# EAGLE design basic-schematic (EAGLE 7.3.0)
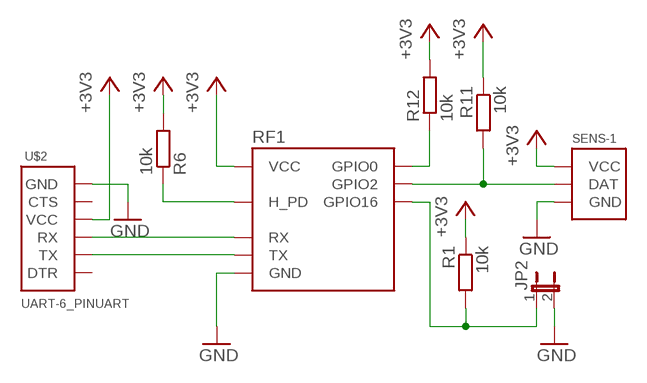
[diagram p0: schematic, sheet 1]

## Parts
JP2  JP1E  [JP1]
R1  10k  R-EU_0207/7  [0207/7]
R6  10k  R-EU_0207/7  [0207/7]
R11  10k  R-EU_0207/7  [0207/7]
R12  10k  R-EU_0207/7  [0207/7]
RF1  ESP2866-ESP-01THT  [ESP8266-ESP-01]
SENS-1  DHT11DHT11  [SENSOR-DHT11]
U$2  UART-6_PINUART  [ANGLE-1X6]

## Nets
+3V3: R1.1 R6.2 R11.1 R12.2 RF1.VCC SENS-1.P$1(VCC) U$2.3(VCC)
GND: JP2.2 RF1.GND SENS-1.P$4(GND) U$2.1(GND)
IO0: R12.1 RF1.GPIO0
IO2: R11.2 RF1.GPIO2 SENS-1.P$2(DAT)
IO16: JP2.1 R1.2 RF1.GPIO16
RESET: R6.1 RF1.H_PD
RX: RF1.RX U$2.4(RX)
TX: RF1.TX U$2.5(TX)
Unconnected: U$2.2(CTS) U$2.6(DTR)

## Library data of the parts
JP2 = jumper:JP1E: JUMPER
R1 R6 R11 R12 = rcl:R-EU_: RESISTOR, European symbol
RF1 = p.peter-periphery:ESP2866-ESP-01
SENS-1 = p.peter-periphery:DHT11
U$2 = p.peter-connectors:UART-6_PIN: RX and TX direction as seen from outside. I.e. connect RX from connector to RX from Atmega

## Board
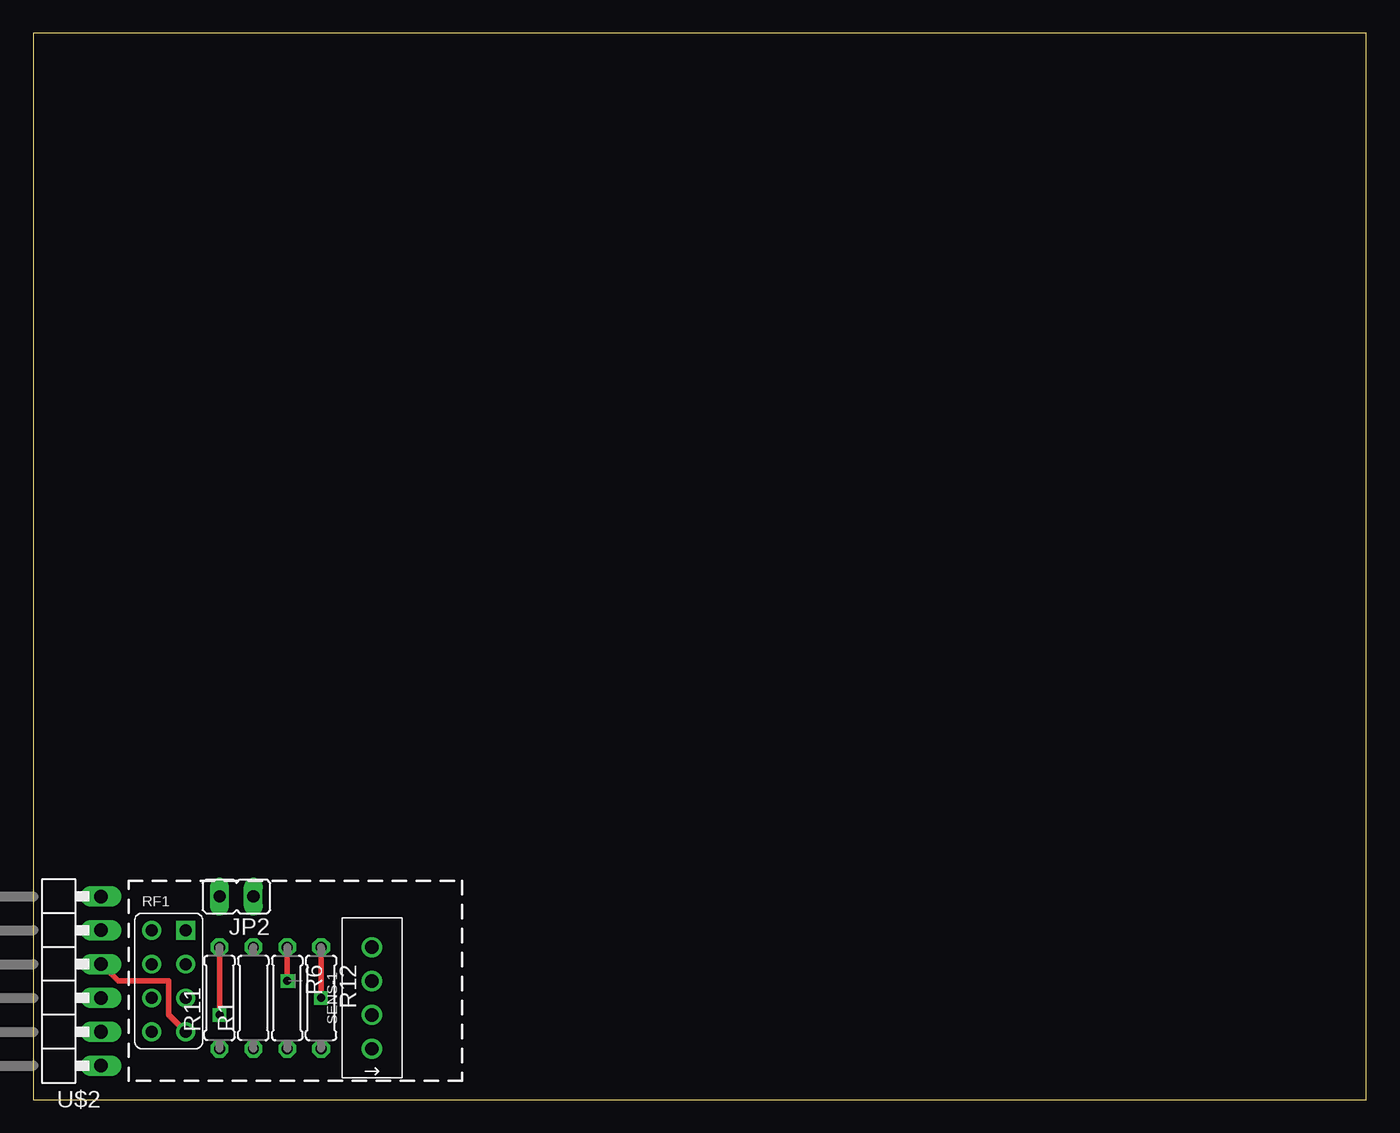
[diagram p1: board, top side]
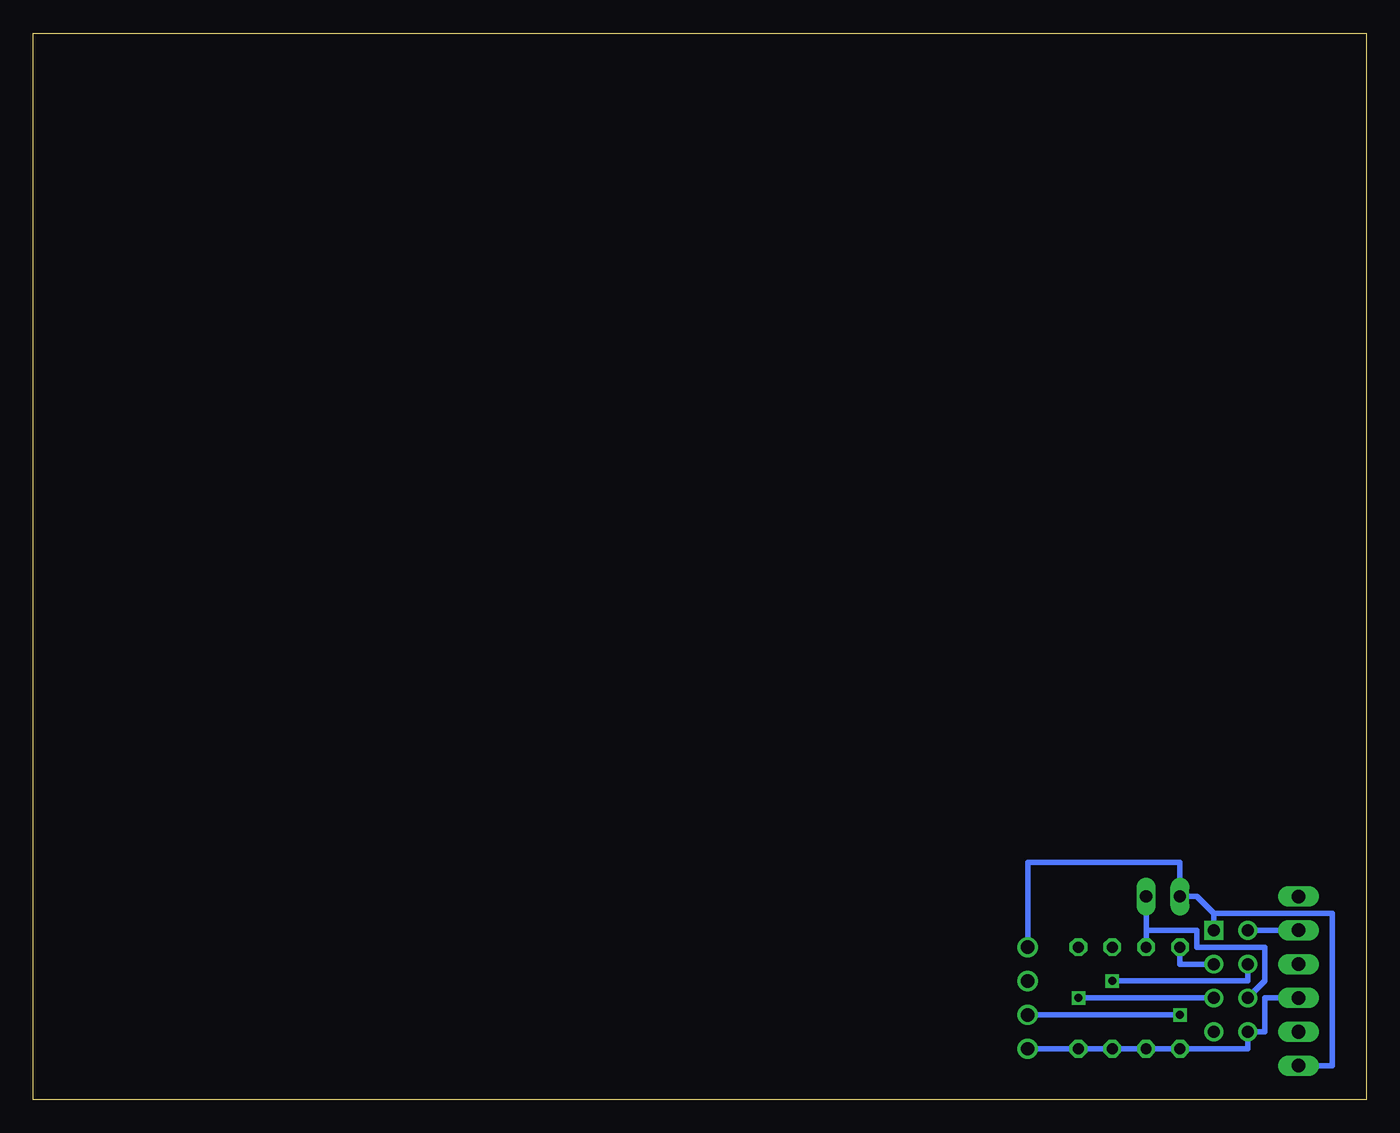
[diagram p2: board, bottom side, seen from below]

Size 100 x 80 mm. Coordinates in mm from the lower left corner, seen from the top.
Outline: 0,0 100,0 100,80 0,80 0,0
Copper layers (1*16): Top 0.035mm / dielectric 1.5mm / Bottom 0.035mm
Design rules "default": minimum track width 10mil, minimum drill 24mil, track to track 8mil, track to pad 8mil, pad to pad 8mil, via to via 8mil, smd to smd 8mil, copper to edge 40mil, drill to drill 8mil, minimum pad ring 10mil, minimum via ring 8mil, stop-mask expansion 4mil, vias tented up to drill 0mil, thermal gap 10mil

### Footprints (pad centres in the part's own frame; a part is rotated, then mirrored left to right if it is on the bottom)
JP1 = drill 0.914 long: 1 0,-1.27; 2 0,1.27
0207/7 = drill 0.813 octagon: 1 -3.81,0; 2 3.81,0
ESP8266-ESP-01 = drill 0.9 square: GND 1.27,3.81 | drill 0.9: GPIO0 1.27,-1.27; GPIO2 1.27,1.27; GPIO16 -1.27,-1.27; H_PD -1.27,1.27; RX 1.27,-3.81; TX -1.27,3.81; VCC -1.27,-3.81
SENSOR-DHT11 = drill 1: P$1 -3.81,0; P$2 -1.27,0; P$3 1.27,0; P$4 3.81,0
ANGLE-1X6 = drill 1.016 long: 1 -6.35,-2.54; 2 -3.81,-2.54; 3 -1.27,-2.54; 4 1.27,-2.54; 5 3.81,-2.54; 6 6.35,-2.54

### Placement (x,y rotation side)
JP2  15.24,15.24 90 top
R1  16.51,7.62 90 top
R6  19.05,7.62 270 top
R11  13.97,7.62 90 top
R12  21.59,7.62 270 top
RF1  10.16,8.89 0 top
SENS-1  25.4,7.62 90 top
U$2  2.54,8.89 90 top

### Tracks (layer width: path | path; a pad name or v marks a point on that pad's centre or on a via)
+3V3
  Bottom 0.406: SENS-1.P$1 R12.2 R6.2 R1.1 R11.1 8.89,3.81 RF1.VCC 7.62,5.08 7.62,7.62 U$2.3
GND
  Bottom 0.406: RF1.GND 11.43,13.97 | 11.43,13.97 12.7,15.24 JP2.2 13.97,16.51 13.97,17.78 25.4,17.78 SENS-1.P$4 | U$2.1 2.54,2.54 2.54,13.97 11.43,13.97
IO0  (via drill 0.6)
  Top 0.406: v21.59,7.62 R12.1
  Bottom 0.406: RF1.GPIO0 v21.59,7.62
IO2  (via drill 0.6)
  Top 0.406: v13.97,6.35 R11.2
  Bottom 0.406: R11.2 13.97,10.16 RF1.GPIO2 | SENS-1.P$2 v13.97,6.35
IO16
  Bottom 0.406: 16.51,12.7 R1.2 16.51,12.7 | 16.51,12.7 JP2.1 | 16.51,12.7 12.7,12.7 12.7,11.43 7.62,11.43 7.62,8.89 RF1.GPIO16
RESET  (via drill 0.6)
  Top 0.406: R6.1 v19.05,8.89
  Bottom 0.406: v19.05,8.89 8.89,8.89 RF1.H_PD
RX
  Top 0.406: RF1.RX 10.16,6.35 10.16,8.89 6.35,8.89 U$2.4
TX
  Bottom 0.406: RF1.TX U$2.5